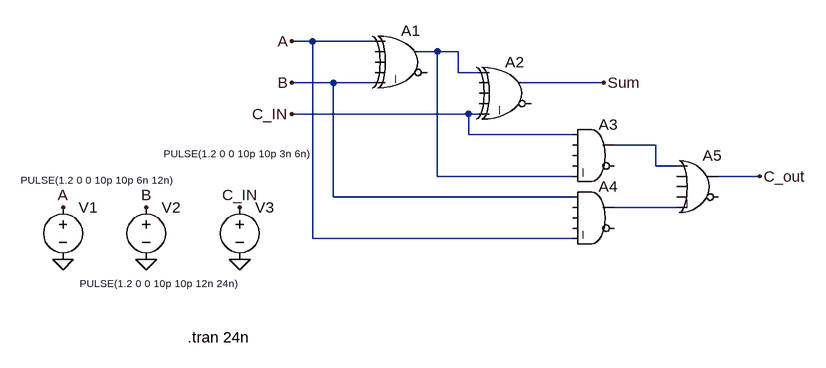
[diagram p0: schematic Full_Adder.asc]
Full_Adder.asc, the LTspice schematic file:
Version 4
SHEET 1 880 680
WIRE -112 16 -144 16
WIRE -16 16 -112 16
WIRE 80 32 48 32
WIRE 112 32 80 32
WIRE 112 64 112 32
WIRE 144 64 112 64
WIRE -80 80 -144 80
WIRE -16 80 -80 80
WIRE 336 80 208 80
WIRE 128 128 -144 128
WIRE 144 128 128 128
WIRE 128 160 128 128
WIRE 288 160 128 160
WIRE 416 176 352 176
WIRE 416 208 416 176
WIRE 448 208 416 208
WIRE 80 224 80 32
WIRE 288 224 80 224
WIRE 576 224 512 224
WIRE -80 256 -80 80
WIRE 288 256 -80 256
WIRE 448 272 352 272
WIRE -112 320 -112 16
WIRE 288 320 -112 320
FLAG 576 224 C_out
FLAG 336 80 Sum
FLAG -144 128 C_IN
FLAG -144 16 A
FLAG -144 80 B
FLAG -224 352 0
FLAG -368 352 0
FLAG -496 352 0
FLAG -496 272 A
FLAG -368 272 B
FLAG -224 272 C_IN
SYMBOL Digital\\xor 32 -16 R0
SYMATTR InstName A1
SYMBOL Digital\\xor 192 32 R0
SYMATTR InstName A2
SYMBOL Digital\\and 320 128 R0
SYMATTR InstName A3
SYMBOL Digital\\and 320 224 R0
SYMATTR InstName A4
SYMBOL Digital\\or 480 176 R0
SYMATTR InstName A5
SYMBOL voltage -496 256 R0
WINDOW 3 -65 -26 Left 1
WINDOW 123 0 0 Left 0
WINDOW 39 0 0 Left 0
SYMATTR Value PULSE(1.2 0 0 10p 10p 6n 12n)
SYMATTR InstName V1
SYMBOL voltage -368 256 R0
WINDOW 3 -102 133 Left 1
WINDOW 123 0 0 Left 0
WINDOW 39 0 0 Left 0
SYMATTR Value PULSE(1.2 0 0 10p 10p 12n 24n)
SYMATTR InstName V2
SYMBOL voltage -224 256 R0
WINDOW 3 -117 -67 Left 1
WINDOW 123 0 0 Left 0
WINDOW 39 0 0 Left 0
SYMATTR Value PULSE(1.2 0 0 10p 10p 3n 6n)
SYMATTR InstName V3
TEXT -304 472 Left 2 !.tran 24n

The netlist it stands for:
* Full_Adder.asc
A1 A 0 0 0 B 0 N001 0 XOR
A2 N001 0 0 0 C_IN 0 Sum 0 XOR
A3 C_IN 0 0 0 N001 0 N002 0 AND
A4 B 0 0 0 A 0 N003 0 AND
A5 N002 0 0 0 N003 0 C_out 0 OR
V1 A 0 PULSE(1.2 0 0 10p 10p 6n 12n)
V2 B 0 PULSE(1.2 0 0 10p 10p 12n 24n)
V3 C_IN 0 PULSE(1.2 0 0 10p 10p 3n 6n)
.tran 24n
.backanno
.end